# EAGLE design ch340c_esp32 (EAGLE 9.6.2)
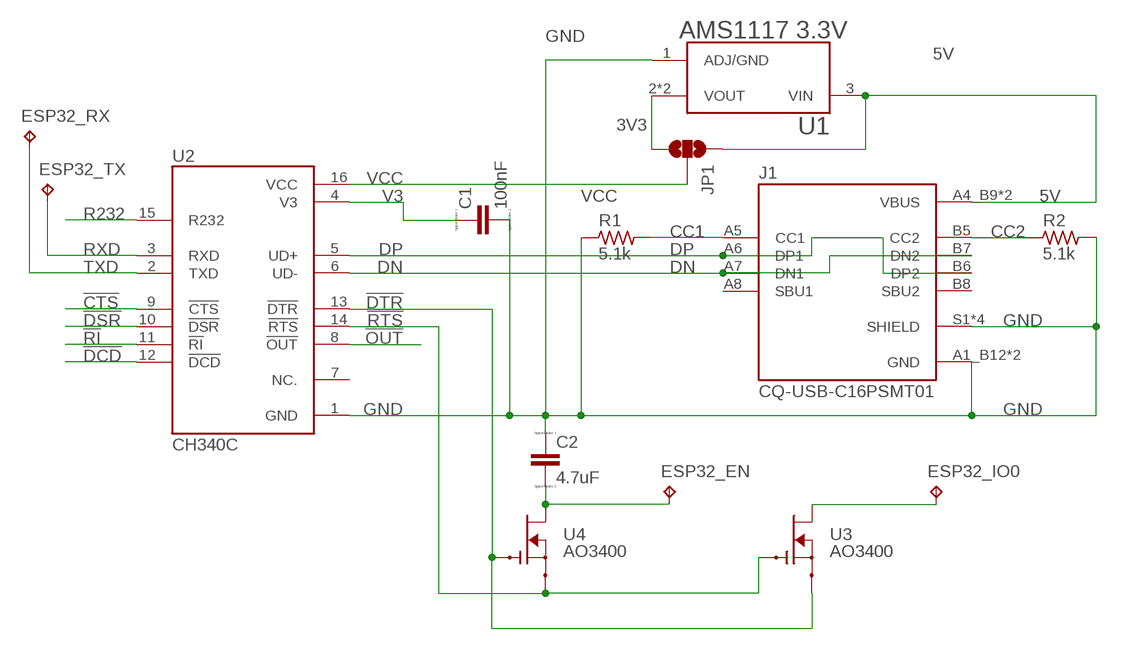
[diagram p0: schematic, sheet 1]

## Parts
C1  100nF  CC0603  [C0603]
C2  4.7uF  CC0603  [C0603]
ESP32_EN  TPB1,27  [B1,27]
ESP32_IO0  TPB1,27  [B1,27]
ESP32_RX  TPB1,27  [B1,27]
ESP32_TX  TPB1,27  [B1,27]
J1  CQ-USB-C16PSMT01  [SHENZHEN-CHUANGQIN-TECHNOLOGY_CQ-USB-C16PSMT01]
JP1  JUMPER-SMT_3_NO_NO-SILK  [SMT-JUMPER_3_NO_NO-SILK]
R1  5.1k  RC-MASTER-SMD_R_0603MP  [RC-MASTER-SMD_R0603MP]
R2  5.1k  RC-MASTER-SMD_R_0603MP  [RC-MASTER-SMD_R0603MP]
U1  AMS1117 3.3V  AMS1117  [SOT229P700X180-4N]
U2  CH340C  [SOIC127P600X180-16N]
U3  AO3400  [SOT23]
U4  AO3400  [SOT23]

## Nets
3V3: JP1.1 U1.2(VOUT) U1.4(VOUT)
5V: J1.A4_B9(VBUS) J1.B4_A9(VBUS) JP1.3 U1.3(VIN)
!CTS: U2.9(!CTS)
!DCD: U2.12(!DCD)
!DSR: U2.10(!DSR)
!DTR: U2.13(!DTR) U3.2(S) U4.1(G)
!OUT: U2.8(!OUT)
!RI: U2.11(!RI)
!RTS: U2.14(!RTS) U3.1(G) U4.2(S)
CC1: J1.A5(CC1) R1.2
CC2: J1.B5(CC2) R2.1
DN: J1.A7(DN1) J1.B7(DN2) U2.6(UD-)
DP: J1.A6(DP1) J1.B6(DP2) U2.5(UD+)
EN: C2.2 ESP32_EN.TP U4.3(D)
GND: C1.2 C2.1 J1.A1_B12(GND) J1.B1_A12(GND) J1.S1(SHIELD) J1.S2(SHIELD) J1.S3(SHIELD) J1.S4(SHIELD) R1.1 R2.2 U1.1(ADJ/GND) U2.1(GND)
IO0: ESP32_IO0.TP U3.3(D)
R232: U2.15(R232)
RXD: ESP32_TX.TP U2.3(RXD)
TXD: ESP32_RX.TP U2.2(TXD)
V3: C1.1 U2.4(V3)
VCC: JP1.2 U2.16(VCC)
Unconnected: J1.A8(SBU1) J1.B8(SBU2) U2.7(NC.)

## Library data of the parts
C1 C2 = eagle-ltspice:C: CAPACITOR, European symbol; SPICEMODEL: NONE; SPICEPREFIX: C
ESP32_EN ESP32_IO0 ESP32_RX ESP32_TX = BeagleBone_Blue_R3:TP: Test pad
J1 = CQ-USB-C16PSMT01:CQ-USB-C16PSMT01: C Type USB Type-C Female Plug 16 Pin Connector Power Charger Jack Port Check availability <https://pricing.snapeda.com/parts/CQ-USB-C16PSMT01/Shenzen%20Chuangqin%20Technology/view-part?ref=eda>; AVAILABILITY: Not in stock; DESCRIPTION: C Type USB Type-C Female Plug 16 Pin Connector Power Charger Jack Port; MF: Shenzen Chuangqin Technology; MP: CQ-USB-C16PSMT01; PACKAGE: Package; PRICE: None
JP1 = SparkFun-Jumpers:JUMPER-SMT_3_NO: Normally open jumper This jumper has three pads in close proximity to each other. Apply solder to close the connection(s).
R1 R2 = 52101-101-REV-A_v16:RC-MASTER-SMD_R_: RESISTOR
U1 = AMS1117:AMS1117: Sot223/Pkg 1-Amp 5-Volt Low Drop Out Voltage Regulatator Check availability <https://pricing.snapeda.com/parts/AMS1117/Advanced%20Monolithic%20Systems/view-part?ref=eda>; AVAILABILITY: Not in stock; CHECK_PRICES: https://www.snapeda.com/parts/AMS1117/Advanced+Monolithic+Systems/view-part/?ref=eda; DESCRIPTION: 1A LOW DROPOUT VOLTAGE REGULATOR SOT-223; MF: Advanced Monolithic Systems; MP: AMS1117; PACKAGE: SOT-223 Seeed Technology; PRICE: None; SNAPEDA_LINK: https://www.snapeda.com/parts/AMS1117/Advanced+Monolithic+Systems/view-part/?ref=snap
U2 = CH340C:CH340C: USB to serial chip CH340 Check availability <https://pricing.snapeda.com/parts/CH340C/WCH/view-part?ref=eda>; AVAILABILITY: Not in stock; CHECK_PRICES: https://www.snapeda.com/parts/CH340C/WCH/view-part/?ref=eda; DESCRIPTION: USB to serial chip CH340; MF: WCH; MP: CH340C; PACKAGE: None; PRICE: None; SNAPEDA_LINK: https://www.snapeda.com/parts/CH340C/WCH/view-part/?ref=snap
U3 U4 = AO3400:AO3400: Check availability <https://pricing.snapeda.com/parts/AO3400/Alpha%20%26/view-part?ref=eda>; AVAILABILITY: In Stock; CHECK_PRICES: https://www.snapeda.com/parts/AO3400/Alpha+%2526+Omega+Semiconductor+Inc./view-part/?ref=eda; DESCRIPTION: N-Channel 30 V 5.8A (Ta) 1.4W (Ta) Surface Mount SOT-23-3; MF: Alpha &; MP: AO3400; PACKAGE: SOT-23-3 Alpha &amp; Omega Semiconductor; PRICE: None; PURCHASE-URL: https://www.snapeda.com/api/url_track_click_mouser/?unipart_id=1321993&manufacturer=Alpha &amp;&part_name=AO3400&search_term=ao3400; SNAPEDA_LINK: https://www.snapeda.com/parts/AO3400/Alpha+%2526+Omega+Semiconductor+Inc./view-part/?ref=snap

## Board
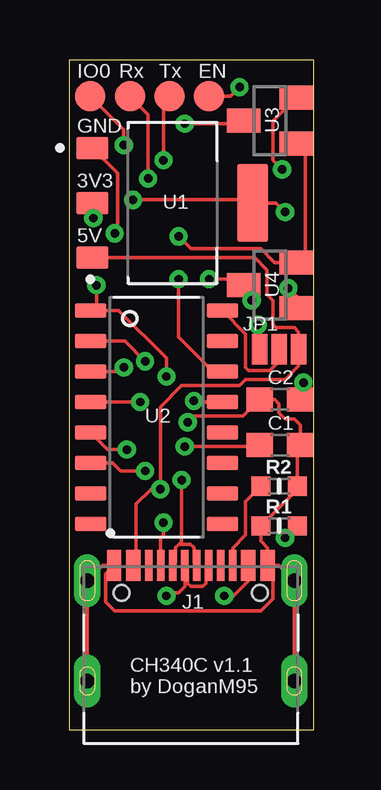
[diagram p1: board, top side]
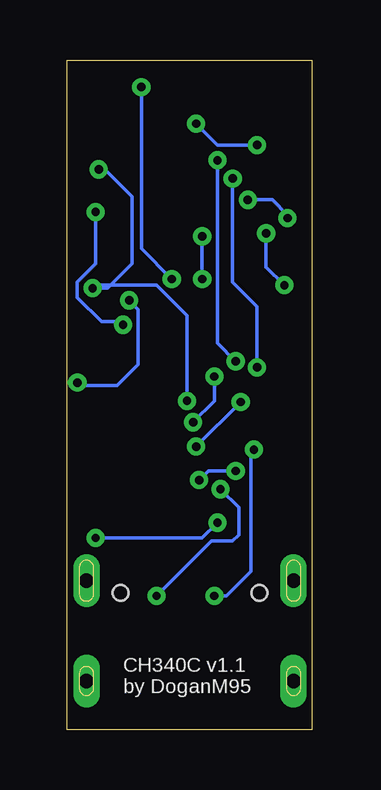
[diagram p2: board, bottom side, seen from below]

Size 10.21 x 27.93 mm. Coordinates in mm from the lower left corner, seen from the top.
Outline: 0,0 10.21,0 10.21,27.93 0,27.93 0,0
Copper layers (1*16): Top 0.035mm / dielectric 1.5mm / Bottom 0.035mm
Design rules "default *": minimum track width 6mil, minimum drill 0.35mm, track to track 6mil, track to pad 6mil, pad to pad 6mil, via to via 6mil, smd to smd 6mil, copper to edge 40mil, drill to drill 6mil, minimum pad ring 10mil, minimum via ring 8mil, stop-mask expansion 4mil, vias tented up to drill 20mil, thermal gap 10mil

### Footprints (pad centres in the part's own frame; a part is rotated, then mirrored left to right if it is on the bottom)
C0603 = smd 1.1 x 1: 1 -0.85,0; 2 0.85,0
B1,27 = smd 1.27 x 1.27: TP 0,0
SHENZHEN-CHUANGQIN-TECHNOLOGY_CQ-USB-C16PSMT01 = smd 0.6 x 1.3: A1_B12 -3.2,0; A4_B9 -2.4,0; B1_A12 3.2,0; B4_A9 2.4,0 | smd 0.3 x 1.3: A5 -1.25,0; A6 -0.25,0; A7 0.25,0; A8 1.25,0; B5 1.75,0; B6 0.75,0; B7 -0.75,0; B8 -1.75,0 | drill 0.6 pad 1.05 long: S1 -4.32,-0.64; S2 4.32,-0.64 | drill 0.6 pad 0.8 long: S3 -4.32,-4.82; S4 4.32,-4.82 | hole 0.65: -2.89,-1.14; 2.89,-1.14
SMT-JUMPER_3_NO_NO-SILK = smd 0.635 x 1.27: 1 -0.813,0; 2 0,0; 3 0.813,0
RC-MASTER-SMD_R0603MP = smd 0.8 x 0.8: 1 -0.762,0; 2 0.762,0
SOT229P700X180-4N = smd 1.31 x 0.93: 1 -3.345,2.29; 2 -3.345,0; 3 -3.345,-2.29 | smd 1.31 x 3.24: 4 3.345,0
SOIC127P600X180-16N = smd 1.31 x 0.62: 1 -2.75,4.445; 2 -2.75,3.175; 3 -2.75,1.905; 4 -2.75,0.635; 5 -2.75,-0.635; 6 -2.75,-1.905; 7 -2.75,-3.175; 8 -2.75,-4.445; 9 2.75,-4.445; 10 2.75,-3.175; 11 2.75,-1.905; 12 2.75,-0.635; 13 2.75,0.635; 14 2.75,1.905; 15 2.75,3.175; 16 2.75,4.445
SOT23 = smd 1 x 1.4: 1 -0.95,-1.1; 2 0.95,-1.1; 3 0,1.1

### Placement (x,y rotation side)
C1  8.8,11.87 0 top
C2  8.8,13.77 0 top
ESP32_EN  5.84,26.42 0 top
ESP32_IO0  0.89,26.42 0 top
ESP32_RX  4.19,26.42 0 top
ESP32_TX  2.54,26.42 0 top
J1  5.08,6.86 0 top
JP1  8.76,15.88 0 top
R1  8.76,8.51 0 top
R2  8.76,10.16 0 top
U1  4.32,21.97 0 top
U2  3.65,13.04 0 top
U3  8.38,25.4 90 top
U4  8.38,18.54 90 top

### Tracks (layer width: path | path; a pad name or v marks a point on that pad's centre or on a via)
3V3  (via drill 0.35)
  Top 0.152: U1.2 1.02,21.93 v1.02,21.34 | v2.67,22.1 7.54,22.1 U1.4 8.64,21.97 v9.02,21.59 | v7.87,16.89 7.87,15.95 JP1.1
  Bottom 0.152: v1.02,21.34 1.02,21.46 1.65,22.1 v2.67,22.1 | v9.02,21.59 9.02,19.43 9.78,18.67 9.78,18.03 8.76,17.02 8,17.02 v7.87,16.89
5V  (via drill 0.35)
  Top 0.152: J1.B4_A9 7.48,6.21 6.86,5.59 v6.48,5.59 | J1.A4_B9 2.81,6.99 2.81,9.41 3.43,10.03 v3.81,10.03 3.81,13.46 4.7,14.35 7.11,14.35 7.37,14.61 9.02,14.61 9.58,15.16 JP1.3 9.58,16.59 9.4,16.76 8.64,16.76 8.51,16.89 8.51,17.91 8.26,18.16 8.26,19.18 7.75,19.68 U1.3
  Bottom 0.152: v6.48,5.59 4.19,7.87 3.3,7.87 3.05,8.13 3.05,9.27 v3.81,10.03
!DTR  (via drill 0.35)
  Top 0.152: U2.13 5.25,13.67 v5.21,13.72 | v9.14,18.41 9.48,18.08 U4.1 | U3.2 8.51,25.38 8.51,23.75 v8.89,23.37
  Bottom 0.152: v5.21,13.72 5.21,17.27 6.48,18.54 9.02,18.54 v9.14,18.41 8.51,18.41 7.49,19.43 7.49,22.23 8.64,23.37 v8.89,23.37
!RTS  (via drill 0.35)
  Top 0.152: v4.57,20.57 5.08,20.07 8,20.07 8.57,19.49 U4.2 9.86,19.87 9.86,24.07 U3.1 | v4.57,18.8 4.57,16.38 6.01,14.94 U2.14
  Bottom 0.152: v4.57,20.57 v4.57,18.8
CC1  (via drill 0.35)
  Top 0.152: R1.2 v9.02,8 | v3.94,8.64 3.94,8.13 3.81,8 3.81,6.88 J1.A5
  Bottom 0.152: v9.02,8 4.57,8 v3.94,8.64
CC2
  Top 0.152: R2.1 7.37,9.53 7.37,8.13 6.83,7.59 J1.B5
DN  (via drill 0.35)
  Top 0.152: 4.58,7.74 4.45,7.6 4.45,6.98 J1.B7 | 4.58,7.74 5.08,7.74 5.21,7.6 5.21,6.98 J1.A7 | 4.58,7.74 4.7,7.85 v4.7,10.41 | U2.6 1.82,11.13 2.16,10.79 v3.17,10.79
  Bottom 0.152: v3.17,10.79 4.32,10.79 v4.7,10.41
DP  (via drill 0.35)
  Top 0.152: J1.B6 5.71,6.74 5.71,6.11 5.58,5.98 5.08,5.98 4.95,6.11 4.95,6.74 J1.A6 4.83,5.97 4.57,5.71 4.19,5.71 v4.06,5.59 | U2.5 1.61,11.68 v2.41,11.68
  Bottom 0.152: v4.06,5.59 3.56,5.59 2.54,6.6 2.54,11.56 v2.41,11.68
EN  (via drill 0.35)
  Top 0.152: ESP32_EN.TP 6.73,26.42 v7.11,26.8 | v5.84,18.8 7.03,18.8 U4.3 7.62,18.2 v7.62,17.91 | C2.2 9.78,13.9 v9.78,14.48
  Bottom 0.152: v7.11,26.8 7.11,20.07 v5.84,18.8 | v7.62,17.91 7.24,17.53 7.24,15.24 8.13,14.35 9.65,14.35 v9.78,14.48
GND  (via drill 0.35)
  Top 0.152: 8.51,6.86 J1.B1_A12 8.28,7.59 8,7.87 R1.1 9.53,10.03 R2.2 9.53,11.74 C1.2 9.65,12.7 9.4,12.95 9.02,12.95 8.76,13.21 8.76,13.59 8.58,13.77 C2.1 7.26,13.08 5.21,13.08 v4.95,12.83 | 8.51,6.86 8.76,6.86 J1.S2 J1.S4 | J1.S3 J1.S1 1.4,6.86 J1.A1_B12 1.52,6.5 1.52,5.33 1.91,4.95 8,4.95 8.51,5.46 8.51,6.86 | v4.06,14.73 4.06,15.49 2.08,17.48 U2.1 1.14,17.73 v1.14,18.54 | U1.1 2.03,23.2 2.03,20.83 v1.91,20.7
  Bottom 0.152: v4.95,12.83 4.06,13.72 v4.06,14.73 | v1.91,20.7 1.91,19.3 v1.14,18.54
IO0  (via drill 0.35)
  Top 0.152: ESP32_IO0.TP 2.29,25.02 v2.29,24.38 | v4.83,25.27 7.16,25.27 U3.3
  Bottom 0.152: v2.29,24.38 3.94,24.38 v4.83,25.27
RXD  (via drill 0.35)
  Top 0.152: U2.3 2.11,14.94 v2.29,15.11 | v3.3,22.99 3.3,25.65 ESP32_TX.TP
  Bottom 0.152: v2.29,15.11 2.29,17.65 3.3,18.67 v3.3,22.99
TXD  (via drill 0.35)
  Top 0.152: U2.2 2.33,16.21 v3.17,15.37 | ESP32_RX.TP 3.94,26.16 v3.94,23.75
  Bottom 0.152: v3.17,15.37 3.94,16.13 v3.94,23.75
V3  (via drill 0.35)
  Top 0.152: U2.4 v2.97,13.67 | v4.83,11.81 7.89,11.81 C1.1
  Bottom 0.152: v2.97,13.67 v4.83,11.81
VCC
  Top 0.152: U2.16 7.37,16.51 7.37,15.11 7.49,14.99 8.38,14.99 8.76,15.37 JP1.2

### Text on the board
tNames: IO0 | Rx | Tx | EN | GND | 3V3 | 5V | JP1 | CH340C v1.1 | by DoganM95
bNames: CH340C v1.1 | by DoganM95